# EAGLE design openmv3 (EAGLE 7.2.0)
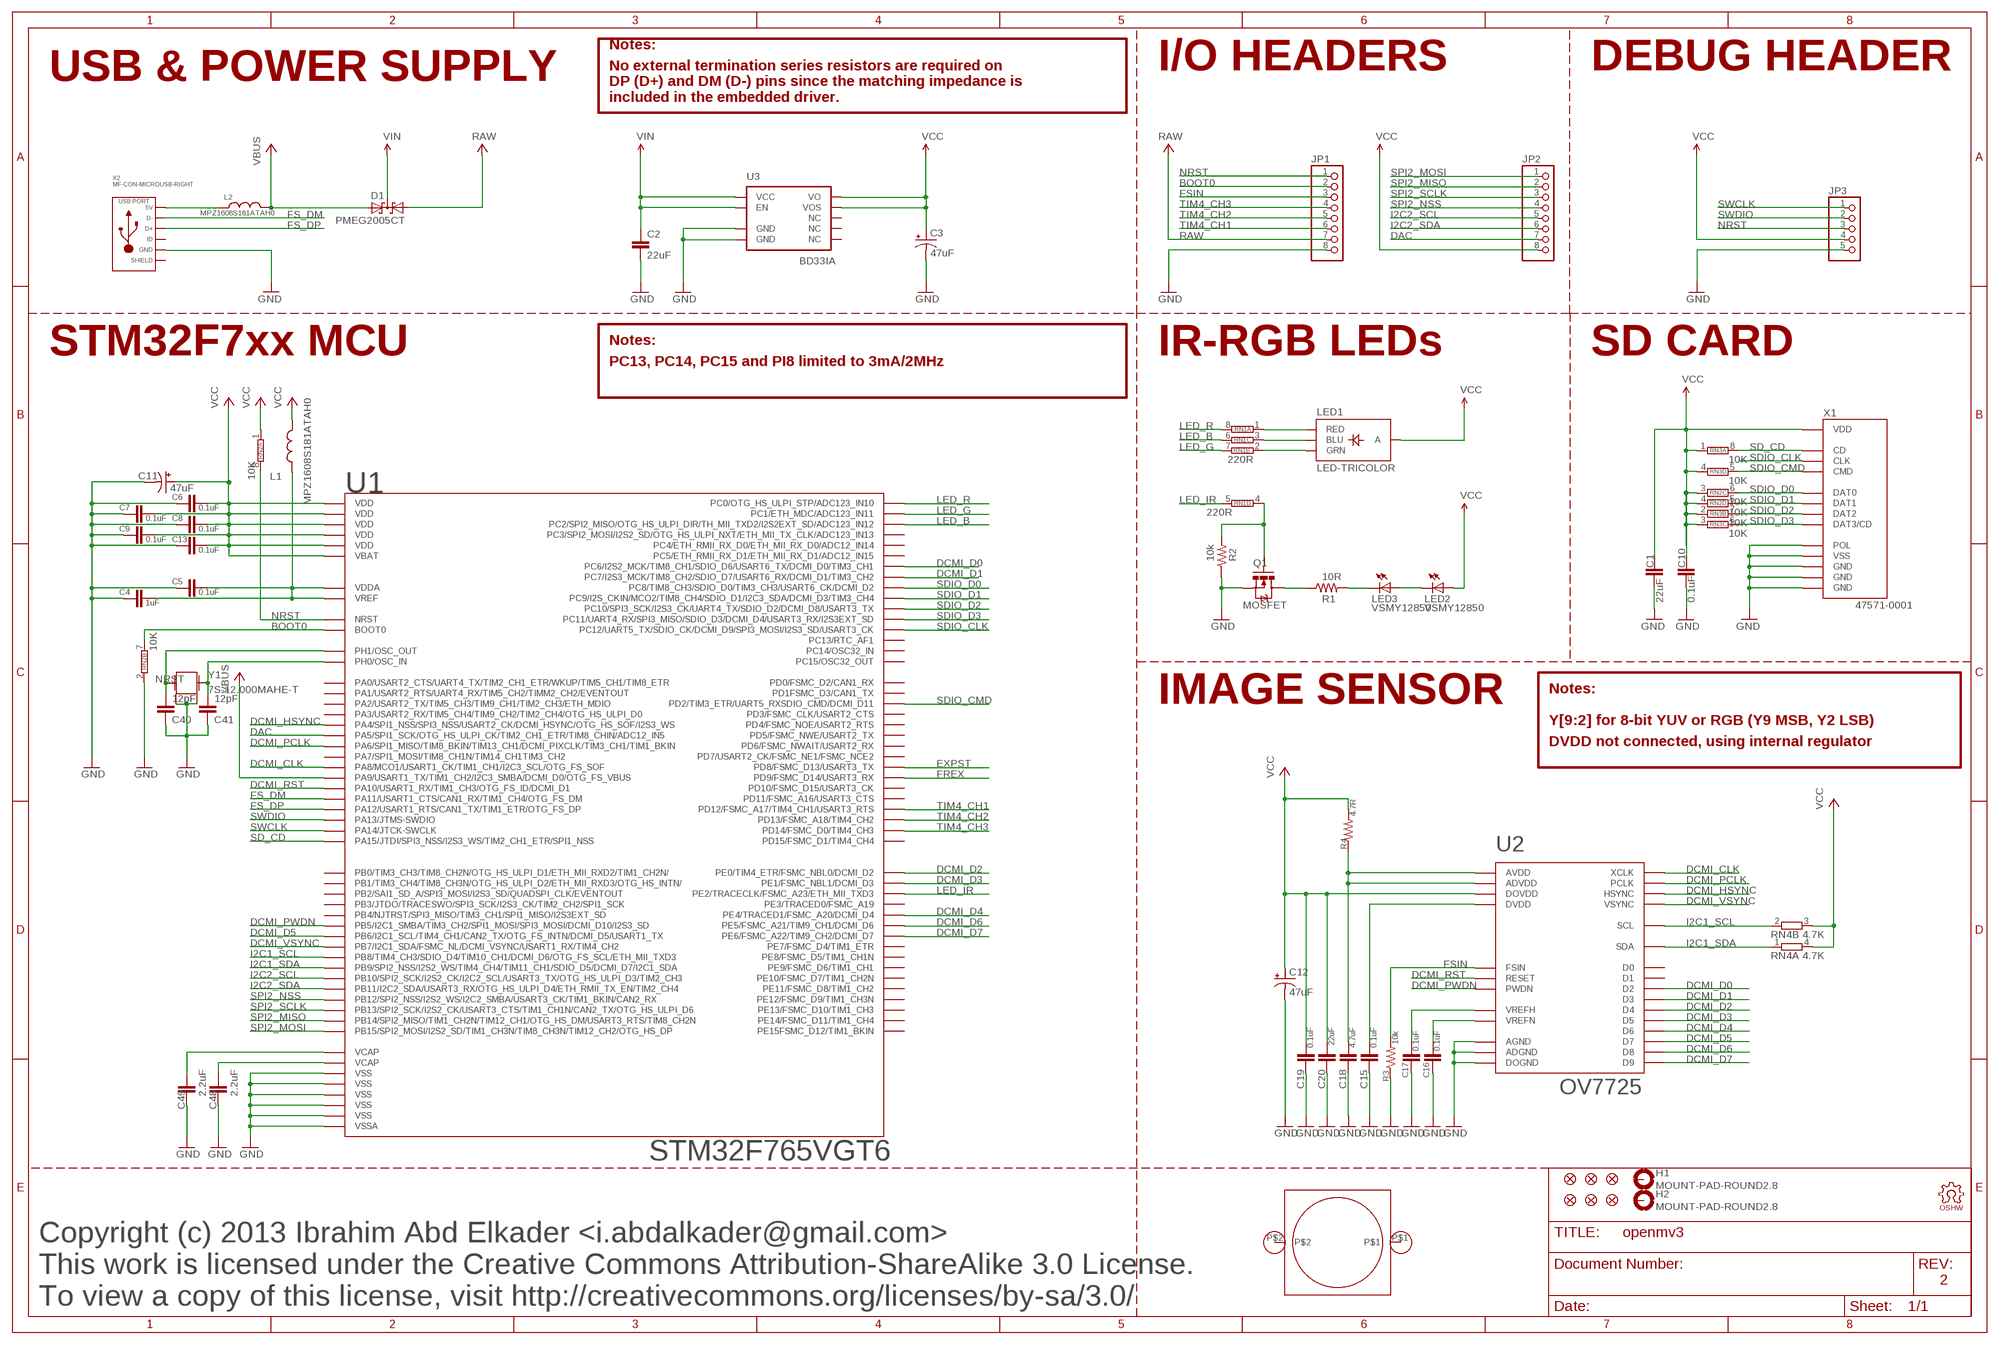
[diagram p0: schematic, sheet 1]

## Parts
C1  22uF  CAP0805  [0805]
C2  22uF  CAP0805  [0805]
C3  47uF  CAP_POL1206  [EIA3216]
C4  1uF  CAP0603-CAP  [0603-CAP]
C5  0.1uF  CAP0603-CAP  [0603-CAP]
C6  0.1uF  CAP0603-CAP  [0603-CAP]
C7  0.1uF  CAP0603-CAP  [0603-CAP]
C8  0.1uF  CAP0603-CAP  [0603-CAP]
C9  0.1uF  CAP0603-CAP  [0603-CAP]
C10  0.1uF  CAP0603-CAP  [0603-CAP]
C11  47uF  CAP_POL1206  [EIA3216]
C12  47uF  CAP_POL1206  [EIA3216]
C13  0.1uF  CAP0603-CAP  [0603-CAP]
C15  0.1uF  CAP0603-CAP  [0603-CAP]
C16  0.1uF  CAP0603-CAP  [0603-CAP]
C17  0.1uF  CAP0603-CAP  [0603-CAP]
C18  4.7uF  CAP0603-CAP  [0603-CAP]
C19  0.1uF  CAP0603-CAP  [0603-CAP]
C20  22uF  CAP0805  [0805]
C40  12pF  CAP0603-CAP  [0603-CAP]
C41  12pF  CAP0603-CAP  [0603-CAP]
C48  2.2uF  CAP0603-CAP  [0603-CAP]
C49  2.2uF  CAP0603-CAP  [0603-CAP]
D1  PMEG2005CT  BAT54C  [SOT23]
F1  FIDUCIAL1X2  [FIDUCIAL-1X2]
F2  FIDUCIAL1X2  [FIDUCIAL-1X2]
F3  FIDUCIAL1X2  [FIDUCIAL-1X2]
F4  FIDUCIAL1X2  [FIDUCIAL-1X2]
F5  FIDUCIAL1X2  [FIDUCIAL-1X2]
F6  FIDUCIAL1X2  [FIDUCIAL-1X2]
H1  MOUNT-PAD-ROUND2.8  [2,8-PAD]
H2  MOUNT-PAD-ROUND2.8  [2,8-PAD]
JP1  PINHD-1X8  [1X08]
JP2  PINHD-1X8  [1X08]
JP3  PINHD-1X5  [1X05]
L1  MPZ1608S181ATAH0  INDUCTOR0603  [0603]
L2  MPZ1608S181ATAH0  INDUCTOR0603  [0603]
LED1  LED-TRICOLOR  [LED-TRICOLOR-SMD-MF]
LED2  VSMY12850  LED1206  [LED-1206]
LED3  VSMY12850  LED1206  [LED-1206]
LM1  LENSMOUNT20MM  [LENSMOUNT-20MM]
LOGO1  OSHW_LOGO_FILLX0100-NT  [OSHW_FILLX100_NOTEXT]
Q1  MOSFET  MOSFET-NCHANNELSMD  [SOT23-3]
R1  10R  RESISTOR0603-RES  [0603-RES]
R2  10k  RESISTOR0603-RES  [0603-RES]
R3  10k  RESISTOR0603-RES  [0603-RES]
R4  4.7R  RESISTOR0603-RES  [0603-RES]
RN1  220R  4R-NEXBV8V  [EXBV8V]
RN2  10K  4R-NEXBV8V  [EXBV8V]
RN3  10K  4R-NEXBV8V  [EXBV8V]
RN4  4.7K  2R-NEXBV4V  [EXBV4V]
U1  STM32F765VGT6  STM32F746LQFP100  [LQFP100]
U2  OV7725  [CSP2-28]
U3  BD33IA  [HTSOP-J8]
X1  47571-0001  USD-47571  [USD-47571]
X2  MF-CON-MICROUSB-RIGHT  USB_MICRO_RIGHT  [MICROUSB-RIGHT]
Y1  7S-12.000MAHE-T  CRYSTAL2.5X2.0  [CRYSTAL-2.5X2.0]

## Nets
BOOT0: JP1.2 RN2.7 U1.94(BOOT0)
DAC: JP2.7 U1.29(PA5/SPI1_SCK/OTG_HS_ULPI_CK/TIM2_CH1_ETR/TIM8_CHIN/ADC12_IN5)
DCMI_CLK: U1.67(PA8/MCO1/USART1_CK/TIM1_CH1/I2C3_SCL/OTG_FS_SOF) U2.F3(XCLK)
DCMI_D0: U1.63(PC6/I2S2_MCK/TIM8_CH1/SDIO_D6/USART6_TX/DCMI_D0/TIM3_CH1) U2.F5(D2)
DCMI_D1: U1.64(PC7/I2S3_MCK/TIM8_CH2/SDIO_D7/USART6_RX/DCMI_D1/TIM3_CH2) U2.F2(D3)
DCMI_D2: U1.97(PE0/TIM4_ETR/FSMC_NBL0/DCMI_D2) U2.D6(D4)
DCMI_D3: U1.98(PE1/FSMC_NBL1/DCMI_D3) U2.D1(D5)
DCMI_D4: U1.3(PE4/TRACED1/FSMC_A20/DCMI_D4) U2.E6(D6)
DCMI_D5: U1.92(PB6/I2C1_SCL/TIM4_CH1/CAN2_TX/OTG_FS_INTN/DCMI_D5/USART1_TX) U2.E1(D7)
DCMI_D6: U1.4(PE5/FSMC_A21/TIM9_CH1/DCMI_D6) U2.F6(D8)
DCMI_D7: U1.5(PE6/FSMC_A22/TIM9_CH2/DCMI_D7) U2.F1(D9)
DCMI_HSYNC: U1.28(PA4/SPI1_NSS/SPI3_NSS/USART2_CK/DCMI_HSYNC/OTG_HS_SOF/I2S3_WS) U2.B6(HSYNC)
DCMI_PCLK: U1.30(PA6/SPI1_MISO/TIM8_BKIN/TIM13_CH1/DCMI_PIXCLK/TIM3_CH1/TIM1_BKIN) U2.E4(PCLK)
DCMI_PWDN: U1.91(PB5/I2C1_SMBA/TIM3_CH2/SPI1_MOSI/SPI3_MOSI/DCMI_D10/I2S3_SD) U2.C1(PWDN)
DCMI_RST: U1.69(PA10/USART1_RX/TIM1_CH3/OTG_FS_ID/DCMI_D1) U2.A2(RESET)
DCMI_VSYNC: U1.93(PB7/I2C1_SDA/FSMC_NL/DCMI_VSYNC/USART1_RX/TIM4_CH2) U2.C6(VSYNC)
EXPST: U1.55(PD8/FSMC_D13/USART3_TX)
FREX: U1.56(PD9/FSMC_D14/USART3_RX)
FS_DM: U1.70(PA11/USART1_CTS/CAN1_RX/TIM1_CH4/OTG_FS_DM) X2.2(D-)
FS_DP: U1.71(PA12/USART1_RTS/CAN1_TX/TIM1_ETR/OTG_FS_DP) X2.3(D+)
FSIN: JP1.3 R3.2 U2.A4(FSIN)
GND: C1.2 C2.2 C3.C(-) C4.2 C5.2 C6.2 C7.2 C8.2 C9.2 C10.2 C11.C(-) C12.C(-) C13.2 C15.2 C16.2 C17.2 C18.2 C19.2 C20.2 C40.1 C41.1 C48.2 C49.2 JP1.8 JP3.5 Q1.2(S) R2.1 R3.1 RN2.2 U1.10(VSS) U1.19(VSSA) U1.26(VSS) U1.49(VSS) U1.74(VSS) U1.99(VSS) U2.B1(ADGND) U2.B4(AGND) U2.F4(DOGND) U3.3(GND) U3.P$1(GND) X1.G$1(GND) X1.G$2(GND) X1.G$3(GND) X1.G$4(POL) X1.P$6(VSS) X2.5(GND) Y1.2 Y1.4
I2C1_SCL: RN4.2 U1.95(PB8/TIM4_CH3/SDIO_D4/TIM10_CH1/DCMI_D6/OTG_FS_SCL/ETH_MII_TXD3) U2.A5(SCL)
I2C1_SDA: RN4.1 U1.96(PB9/SPI2_NSS/I2S2_WS/TIM4_CH4/TIM11_CH1/SDIO_D5/DCMI_D7/I2C1_SDA) U2.B5(SDA)
I2C2_SCL: JP2.5 U1.46(PB10/SPI2_SCK/I2S2_CK/I2C2_SCL/USART3_TX/OTG_HS_ULPI_D3/TIM2_CH3)
I2C2_SDA: JP2.6 U1.47(PB11/I2C2_SDA/USART3_RX/OTG_HS_ULPI_D4/ETH_RMII_TX_EN/TIM2_CH4)
LED_B: RN1.6 U1.17(PC2/SPI2_MISO/OTG_HS_ULPI_DIR/TH_MII_TXD2/I2S2EXT_SD/ADC123_IN12)
LED_G: RN1.7 U1.16(PC1/ETH_MDC/ADC123_IN11)
LED_IR: RN1.5 U1.1(PE2/TRACECLK/FSMC_A23/ETH_MII_TXD3)
LED_R: RN1.8 U1.15(PC0/OTG_HS_ULPI_STP/ADC123_IN10)
N$1: C17.1 U2.A3(VREFH)
N$2: C40.2 U1.13(PH1/OSC_OUT) Y1.3
N$3: C16.1 U2.B2(VREFN)
N$4: C41.2 U1.12(PH0/OSC_IN) Y1.1
N$5: Q1.1(G) R2.2 RN1.4
N$6: LED1.B(BLU) RN1.3
N$7: L2.1 X2.1(5V)
N$8: LED1.R(RED) RN1.1
N$9: LED1.G(GRN) RN1.2
N$10: LED3.C R1.2
N$12: C4.1 C5.1 L1.1 U1.20(VREF) U1.21(VDDA)
N$13: C18.1 R4.1 U2.A1(ADVDD) U2.B3(AVDD)
N$14: Q1.3(D) R1.1
N$15: C15.1 U2.E3(DVDD)
N$17: LED2.C LED3.A
NRST: JP1.1 JP3.3 RN2.8 U1.14(NRST)
RAW: D1.1(A1) JP1.7
SD_CD: RN3.8 U1.77(PA15/JTDI/SPI3_NSS/I2S3_WS/TIM2_CH1_ETR/SPI1_NSS) X1.G$5(CD)
SDIO_CLK: U1.80(PC12/UART5_TX/SDIO_CK/DCMI_D9/SPI3_MOSI/I2S3_SD/USART3_CK) X1.P$5(CLK)
SDIO_CMD: RN3.5 U1.83(PD2/TIM3_ETR/UART5_RXSDIO_CMD/DCMI_D11) X1.P$3(CMD)
SDIO_D0: RN2.6 U1.65(PC8/TIM8_CH3/SDIO_D0/TIM3_CH3/USART6_CK/DCMI_D2) X1.P$7(DAT0)
SDIO_D1: RN2.5 U1.66(PC9/I2S_CKIN/MCO2/TIM8_CH4/SDIO_D1/I2C3_SDA/DCMI_D3/TIM3_CH4) X1.P$8(DAT1)
SDIO_D2: RN3.7 U1.78(PC10/SPI3_SCK/I2S3_CK/UART4_TX/SDIO_D2/DCMI_D8/USART3_TX) X1.P$1(DAT2)
SDIO_D3: RN3.6 U1.79(PC11/UART4_RX/SPI3_MISO/SDIO_D3/DCMI_D4/USART3_RX/I2S3EXT_SD) X1.P$2(DAT3/CD)
SPI2_MISO: JP2.2 U1.53(PB14/SPI2_MISO/TIM1_CH2N/TIM12_CH1/OTG_HS_DM/USART3_RTS/TIM8_CH2N)
SPI2_MOSI: JP2.1 U1.54(PB15/SPI2_MOSI/I2S2_SD/TIM1_CH3N/TIM8_CH3N/TIM12_CH2/OTG_HS_DP)
SPI2_NSS: JP2.4 U1.51(PB12/SPI2_NSS/I2S2_WS/I2C2_SMBA/USART3_CK/TIM1_BKIN/CAN2_RX)
SPI2_SCLK: JP2.3 U1.52(PB13/SPI2_SCK/I2S2_CK/USART3_CTS/TIM1_CH1N/CAN2_TX/OTG_HS_ULPI_D6)
SWCLK: JP3.1 U1.76(PA14/JTCK-SWCLK)
SWDIO: JP3.2 U1.72(PA13/JTMS-SWDIO)
TIM4_CH1: JP1.6 U1.59(PD12/FSMC_A17/TIM4_CH1/USART3_RTS)
TIM4_CH2: JP1.5 U1.60(PD13/FSMC_A18/TIM4_CH2)
TIM4_CH3: JP1.4 U1.61(PD14/FSMC_D0/TIM4_CH3)
VBUS: D1.2(A2) L2.2 U1.68(PA9/USART1_TX/TIM1_CH2/I2C3_SMBA/DCMI_D0/OTG_FS_VBUS)
VCAP1: C49.1 U1.48(VCAP)
VCAP2: C48.1 U1.73(VCAP)
VCC: C1.1 C3.A(+) C6.1 C7.1 C8.1 C9.1 C10.1 C11.A(+) C12.A(+) C13.1 C19.1 C20.1 JP2.8 JP3.4 L1.2 LED1.A LED2.A R4.2 RN2.1 RN2.3 RN2.4 RN3.1 RN3.2 RN3.3 RN3.4 RN4.3 RN4.4 U1.6(VBAT) U1.11(VDD) U1.27(VDD) U1.50(VDD) U1.75(VDD) U1.100(VDD) U2.E5(DOVDD) U3.1(VO) U3.2(VOS) X1.P$4(VDD)
VIN: C2.1 D1.3(CC) U3.5(EN) U3.8(VCC)
Unconnected: H1.B2,8(MOUNT) H2.B2,8(MOUNT) LM1.P$1 LM1.P$2 U1.2(PE3/TRACED0/FSMC_A19) U1.7(PC13/RTC_AF1) U1.8(PC14/OSC32_IN) U1.9(PC15/OSC32_OUT) U1.18(PC3/SPI2_MOSI/I2S2_SD/OTG_HS_ULPI_NXT/ETH_MII_TX_CLK/ADC123_IN13) U1.22(PA0/USART2_CTS/UART4_TX/TIM2_CH1_ETR/WKUP/TIM5_CH1/TIM8_ETR) U1.23(PA1/USART2_RTS/UART4_RX/TIM5_CH2/TIMM2_CH2/EVENTOUT) U1.24(PA2/USART2_TX/TIM5_CH3/TIM9_CH1/TIM2_CH3/ETH_MDIO) U1.25(PA3/USART2_RX/TIM5_CH4/TIM9_CH2/TIM2_CH4/OTG_HS_ULPI_D0) U1.31(PA7/SPI1_MOSI/TIM8_CH1N/TIM14_CH1TIM3_CH2) U1.32(PC4/ETH_RMII_RX_D0/ETH_MII_RX_D0/ADC12_IN14) U1.33(PC5/ETH_RMII_RX_D1/ETH_MII_RX_D1/ADC12_IN15) U1.34(PB0/TIM3_CH3/TIM8_CH2N/OTG_HS_ULPI_D1/ETH_MII_RXD2/TIM1_CH2N/) U1.35(PB1/TIM3_CH4/TIM8_CH3N/OTG_HS_ULPI_D2/ETH_MII_RXD3/OTG_HS_INTN/) U1.36(PB2/SAI1_SD_A/SPI3_MOSI/I2S3_SD/QUADSPI_CLK/EVENTOUT) U1.37(PE7/FSMC_D4/TIM1_ETR) U1.38(PE8/FSMC_D5/TIM1_CH1N) U1.39(PE9/FSMC_D6/TIM1_CH1) U1.40(PE10/FSMC_D7/TIM1_CH2N) U1.41(PE11/FSMC_D8/TIM1_CH2) U1.42(PE12/FSMC_D9/TIM1_CH3N) U1.43(PE13/FSMC_D10/TIM1_CH3) U1.44(PE14/FSMC_D11/TIM1_CH4) U1.45(PE15FSMC_D12/TIM1_BKIN) U1.57(PD10/FSMC_D15/USART3_CK) U1.58(PD11/FSMC_A16/USART3_CTS) U1.62(PD15/FSMC_D1/TIM4_CH4) U1.81(PD0/FSMC_D2/CAN1_RX) U1.82(PD1FSMC_D3/CAN1_TX) U1.84(PD3/FSMC_CLK/USART2_CTS) U1.85(PD4/FSMC_NOE/USART2_RTS) U1.86(PD5/FSMC_NWE/USART2_TX) U1.87(PD6/FSMC_NWAIT/USART2_RX) U1.88(PD7/USART2_CK/FSMC_NE1/FSMC_NCE2) U1.89(PB3/JTDO/TRACESWO/SPI3_SCK/I2S3_CK/TIM2_CH2/SPI1_SCK) U1.90(PB4/NJTRST/SPI3_MISO/TIM3_CH1/SPI1_MISO/I2S3EXT_SD) U2.A6(D0) U2.E2(D1) U3.4(NC) U3.6(NC) U3.7(NC) X2.4(ID) X2.S1(SLD) X2.S2(SLD) X2.S3(SLD) X2.S4(SLD) X2.S5(SLD) X2.S6(SLD)

## Notes on the sheet
- Notes:
- USB & POWER SUPPLY | I/O HEADERS | DEBUG HEADER
- No external termination series resistors are required on
  DP (D+) and DM (D-) pins since the matching impedance is
  included in the embedded driver.
- Notes:
- STM32F7xx MCU | IR-RGB LEDs | SD CARD
- PC13, PC14, PC15 and PI8 limited to 3mA/2MHz
- Notes:
- IMAGE SENSOR
- Y[9:2] for 8-bit YUV or RGB (Y9 MSB, Y2 LSB)
- DVDD not connected, using internal regulator
- Copyright (c) 2013 Ibrahim Abd Elkader <i.abdalkader@gmail.com>
- This work is licensed under the Creative Commons Attribution-ShareAlike 3.0 License.
- 2
- To view a copy of this license, visit http://creativecommons.org/licenses/by-sa/3.0/

## Library data of the parts
C1 C2 C4-C10 C13 C15-C20 C40 C41 C48 C49 = sfe:CAP: Capacitor Standard 0603 ceramic capacitor, and 0.1" leaded capacitor.
C3 C11 C12 = sfe:CAP_POL: Capacitor Polarized These are standard SMD and PTH capacitors. Normally 10uF, 47uF, and 100uF in electrolytic and tantalum varieties. Always verify the external diameter of the through hole cap, it varies with capacity, voltage, and manufacturer. The EIA devices should be standard.
D1 = diode:BAT54C: Schottky Diodes Source: Fairchild .. BAT54.pdf
F1-F6 = sfe:FIDUCIAL: Fiducial Alignment Points Various fiducial points for machine vision alignment.
H1 H2 = holes:MOUNT-PAD-ROUND: MOUNTING PAD, round
JP1 JP2 = pinhead:PINHD-1X8: PIN HEADER
JP3 = pinhead:PINHD-1X5: PIN HEADER
L1 L2 = sfe:INDUCTOR: Inductors Basic Inductor/Choke - 0603 and 1206. Footprints are not proven and vary greatly between part numbers.
LED1 = sfe:LED-TRICOLOR: Tri-Color LED SMD Proven layout and schematic for triple color LED in SMD package - common anode. Spark Fun Electronics SKU : COM-07844
LED2 LED3 = sfe:LED: LEDs Standard schematic elements and footprints for 5mm, 3mm, 1206, and 0603 sized LEDs. 5mm - Spark Fun Electronics SKU : COM-00529 (and others)
LM1 = omnivision:LENSMOUNT
LOGO1 = iofault:OSHW_LOGO_FILL
Q1 = sfe:MOSFET-NCHANNEL
R1-R4 = sfe:RESISTOR: Resistor Basic schematic elements and footprints for 0603, 1206, and PTH resistors.
RN1-RN3 = resistor-dil:4R-N: Array Chip Resistor Source: RS Component / Phycomp; OC_FARNELL: unknown; OC_NEWARK: unknown
RN4 = resistor-dil:2R-N: Array Chip Resistor Source: Panasonic; OC_FARNELL: unknown; OC_NEWARK: unknown
U1 = stm32:STM32F746
U2 = omnivision:OV7725
U3 = mux:BD33IA
X1 = mux:USD-47571
X2 = MF_Connectors:USB: Library: MF_Connectors Description: 5 Pin USB Connectors. SLD is the shield connection. Usually tied to ground through a small ferrite bead.
Y1 = mux:CRYSTAL: Crystals Various standard crystals. Proven footprints. Spark Fun Electronics SKU : COM-00534

## Board
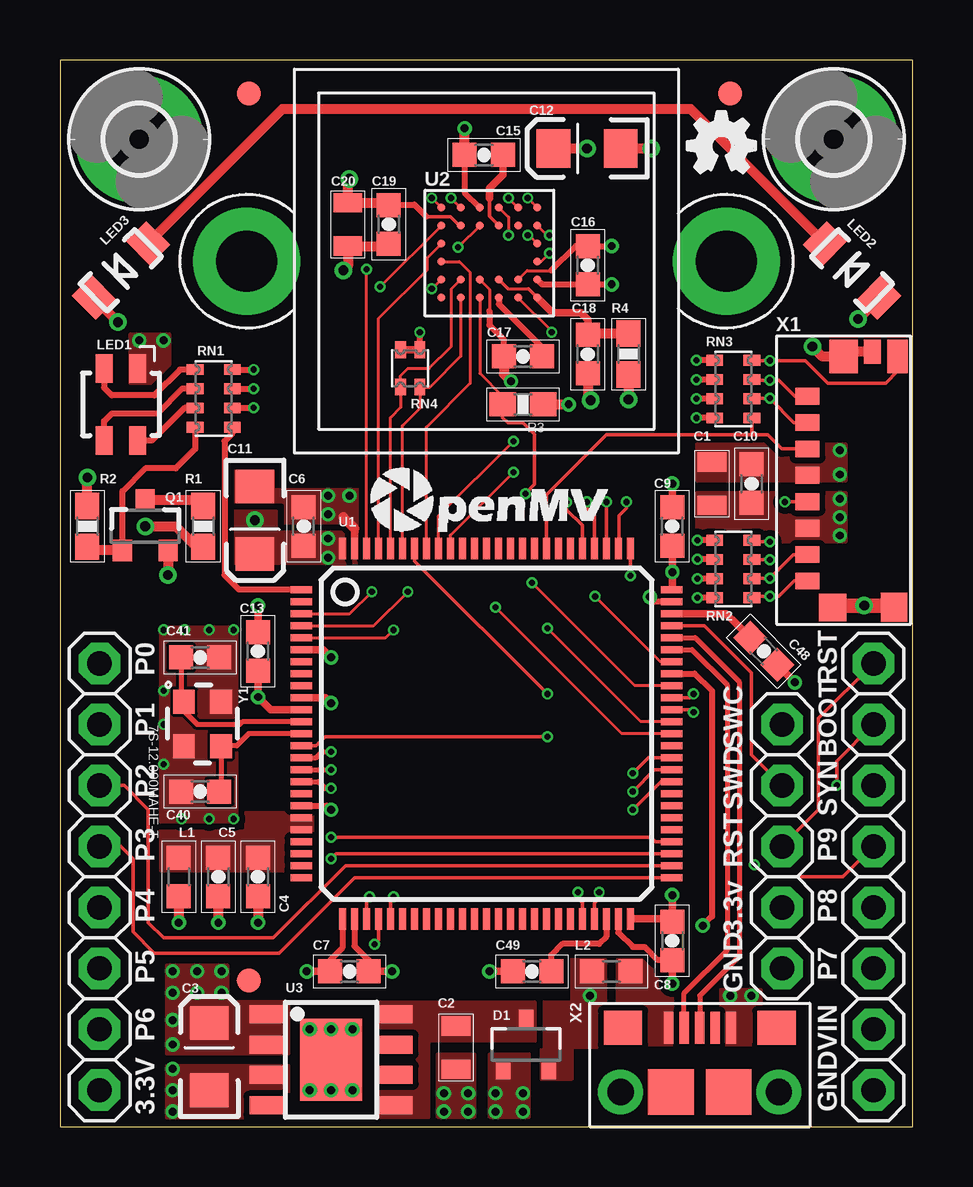
[diagram p1: board, top side]
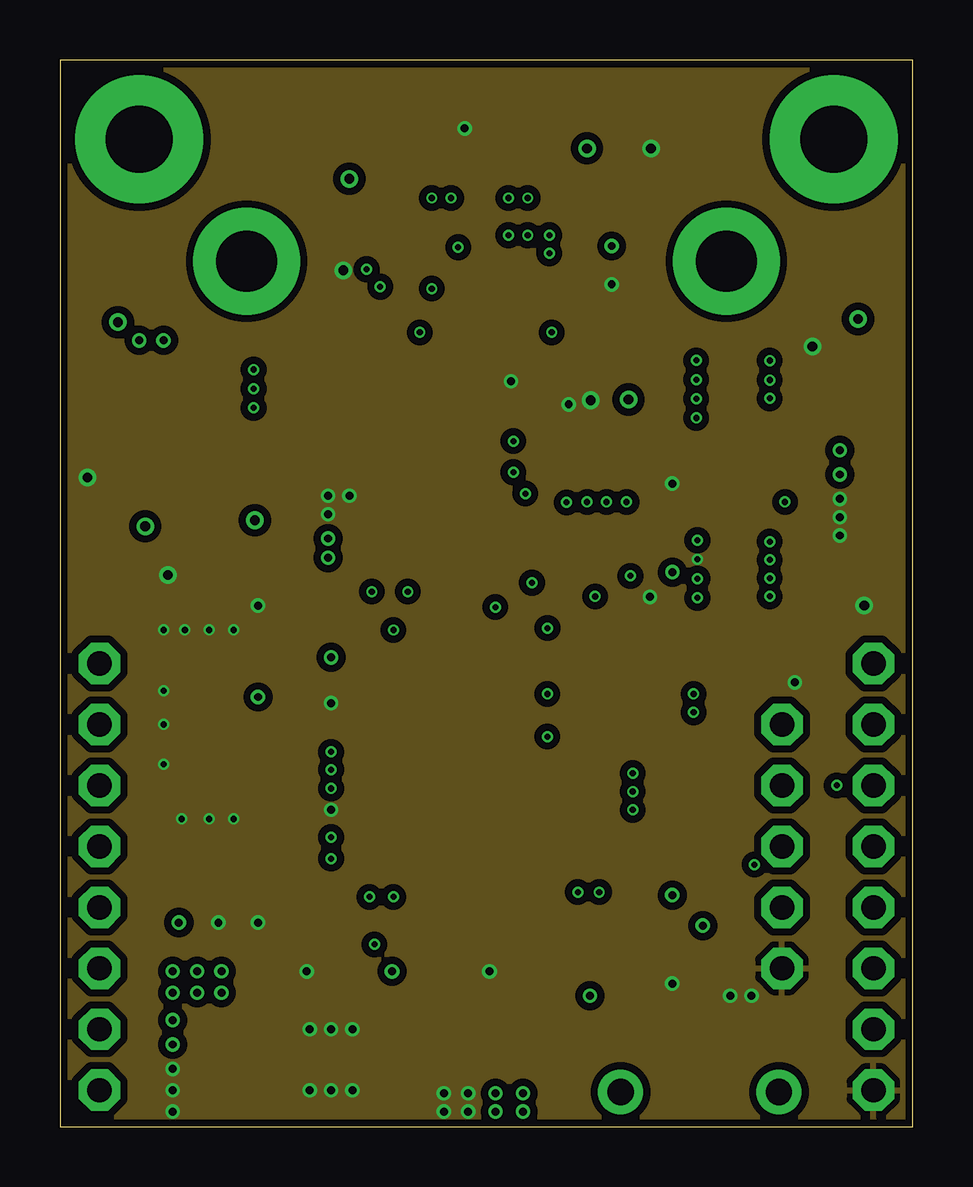
[diagram p2: board, inner layer GND]
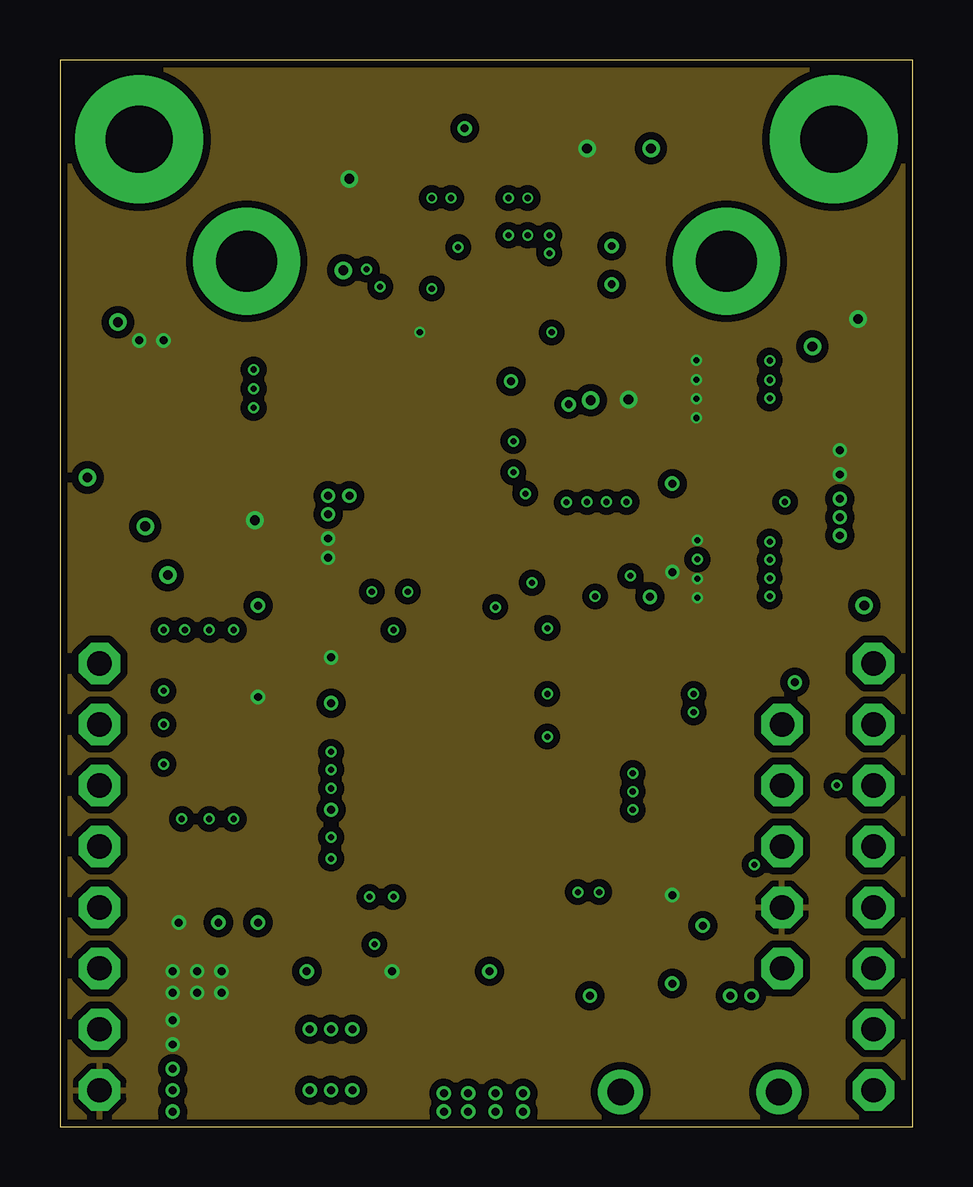
[diagram p3: board, inner layer VCC]
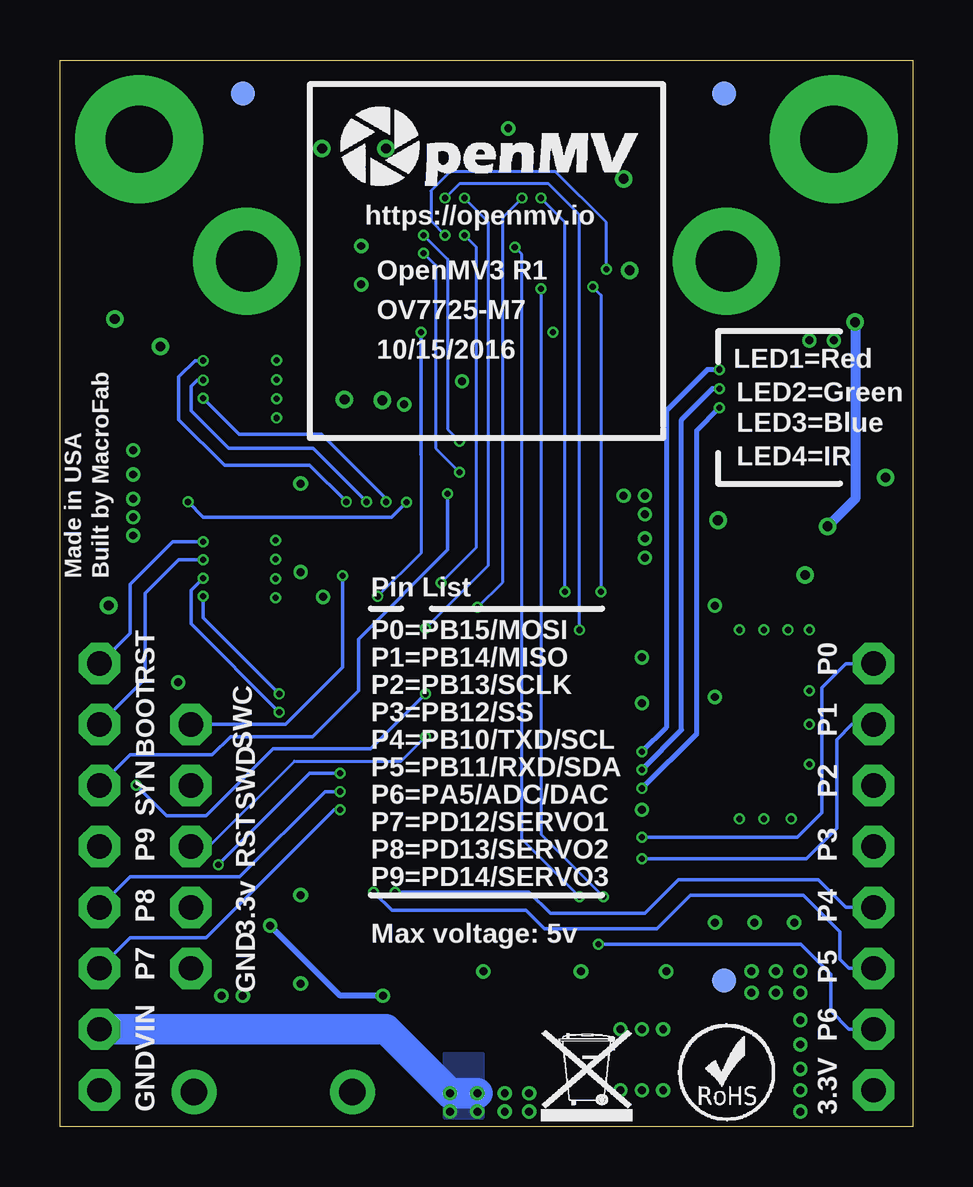
[diagram p4: board, bottom side, seen from below]

Size 35.56 x 44.45 mm. Coordinates in mm from the lower left corner, seen from the top.
Outline: 0,44.45 0,0 35.56,0 35.56,44.45 0,44.45
Copper layers (1*2+15*16): Top 0.035mm / dielectric 1.5mm / GND 0.035mm / dielectric 0.15mm / VCC 0.035mm / dielectric 0.2mm / Bottom 0.035mm
Design rules "default": minimum track width 5mil, minimum drill 10mil, track to track 5mil, track to pad 5mil, pad to pad 5mil, via to via 5mil, smd to smd 5mil, copper to edge 5mil, drill to drill 10mil, minimum pad ring 10mil, minimum via ring 4mil, stop-mask expansion 2mil, vias tented up to drill 30mil, thermal gap 10mil

### Footprints (pad centres in the part's own frame; a part is rotated, then mirrored left to right if it is on the bottom)
0805 = smd 0.8 x 1.2: 1 -0.9,0; 2 0.9,0
EIA3216 = smd 1.4 x 1.6: A 1.4,0; C -1.4,0
0603-CAP = smd 1 x 1: 1 -0.8,0; 2 0.8,0
SOT23 = smd 0.6 x 0.7: 1 -0.95,-1.1; 2 0.95,-1.1; 3 0,1.1
FIDUCIAL-1X2 = smd 1 x 1: 1 0,0
2,8-PAD = drill 2.8 pad 5.334: B2,8 0,0
1X08 = drill 1.016 octagon: 1 -8.89,0; 2 -6.35,0; 3 -3.81,0; 4 -1.27,0; 5 1.27,0; 6 3.81,0; 7 6.35,0; 8 8.89,0
1X05 = drill 1.016 octagon: 1 -5.08,0; 2 -2.54,0; 3 0,0; 4 2.54,0; 5 5.08,0
0603 = smd 1 x 1: 1 -0.8,0; 2 0.8,0
LED-TRICOLOR-SMD-MF = smd 0.7 x 1.2: A 0.7,1.5; B 0.7,-1.5; G -0.7,-1.5; R -0.7,1.5
LED-1206 = smd 1.2 x 1.4: A -1.6,0; C 1.6,0
LENSMOUNT-20MM = drill 2.54 pad 4.445: P$1 -10,0; P$2 10,0
SOT23-3 = smd 0.8 x 0.9: 1 -0.95,-1; 2 0.95,-1; 3 0,1.1
0603-RES = smd 1.1 x 1: 1 -0.85,0; 2 0.85,0
EXBV8V = smd 0.45 x 0.7: 1 -1.2,-0.775; 2 -0.4,-0.775; 3 0.4,-0.775; 4 1.2,-0.775; 5 1.2,0.775; 6 0.4,0.775; 7 -0.4,0.775; 8 -1.2,0.775
EXBV4V = smd 0.45 x 0.7: 1 -0.4,-0.775; 2 0.4,-0.775; 3 0.4,0.775; 4 -0.4,0.775
LQFP100 = smd 0.9 x 0.3: 1 -7.72,6; 2 -7.72,5.5; 3 -7.72,5; 4 -7.72,4.5; 5 -7.72,4; 6 -7.72,3.5; 7 -7.72,3; 8 -7.72,2.5; 9 -7.72,2; 10 -7.72,1.5; 11 -7.72,1; 12 -7.72,0.5; 13 -7.72,0; 14 -7.72,-0.5; 15 -7.72,-1; 16 -7.72,-1.5; 17 -7.72,-2; 18 -7.72,-2.5; 19 -7.72,-3; 20 -7.72,-3.5; 21 -7.72,-4; 22 -7.72,-4.5; 23 -7.72,-5; 24 -7.72,-5.5; 25 -7.72,-6; 51 7.72,-6; 52 7.72,-5.5; 53 7.72,-5; 54 7.72,-4.5; 55 7.72,-4; 56 7.72,-3.5; 57 7.72,-3; 58 7.72,-2.5; 59 7.72,-2; 60 7.72,-1.5; 61 7.72,-1; 62 7.72,-0.5; 63 7.72,0; 64 7.72,0.5; 65 7.72,1; 66 7.72,1.5; 67 7.72,2; 68 7.72,2.5; 69 7.72,3; 70 7.72,3.5; 71 7.72,4; 72 7.72,4.5; 73 7.72,5; 74 7.72,5.5; 75 7.72,6 | smd 0.3 x 0.9: 26 -6,-7.72; 27 -5.5,-7.72; 28 -5,-7.72; 29 -4.5,-7.72; 30 -4,-7.72; 31 -3.5,-7.72; 32 -3,-7.72; 33 -2.5,-7.72; 34 -2,-7.72; 35 -1.5,-7.72; 36 -1,-7.72; 37 -0.5,-7.72; 38 0,-7.72; 39 0.5,-7.72; 40 1,-7.72; 41 1.5,-7.72; 42 2,-7.72; 43 2.5,-7.72; 44 3,-7.72; 45 3.5,-7.72; 46 4,-7.72; 47 4.5,-7.72; 48 5,-7.72; 49 5.5,-7.72; 50 6,-7.72; 76 6,7.72; 77 5.5,7.72; 78 5,7.72; 79 4.5,7.72; 80 4,7.72; 81 3.5,7.72; 82 3,7.72; 83 2.5,7.72; 84 2,7.72; 85 1.5,7.72; 86 1,7.72; 87 0.5,7.72; 88 0,7.72; 89 -0.5,7.72; 90 -1,7.72; 91 -1.5,7.72; 92 -2,7.72; 93 -2.5,7.72; 94 -3,7.72; 95 -3.5,7.72; 96 -4,7.72; 97 -4.5,7.72; 98 -5,7.72; 99 -5.5,7.72; 100 -6,7.72
CSP2-28 = smd 0.34 x 0.34: A1 -2,1.85; A2 -1.2,1.85; A3 -0.4,1.85; A4 0.4,1.85; A5 1.2,1.85; A6 2,1.85; B1 -2,1.1; B2 -1.2,1.1; B3 -0.4,1.1; B4 0.4,1.1; B5 1.2,1.1; B6 2,1.1; C1 -2,0.35; C6 2,0.35; D1 -2,-0.4; D6 2,-0.4; E1 -2,-1.15; E2 -1.2,-1.15; E3 -0.4,-1.15; E4 0.4,-1.15; E5 1.2,-1.15; E6 2,-1.15; F1 -2,-1.9; F2 -1.2,-1.9; F3 -0.4,-1.9; F4 0.4,-1.9; F5 1.2,-1.9; F6 2,-1.9
HTSOP-J8 = smd 0.75 x 1.4: 1 -1.905,-2.7; 2 -0.635,-2.7; 3 0.635,-2.7; 4 1.905,-2.7; 5 1.905,2.7; 6 0.635,2.7; 7 -0.635,2.7; 8 -1.905,2.7 | smd 3.4 x 2.6: P$1 0,0
USD-47571 = smd 1.15 x 1.15: G$1 -4.9,0.55 | smd 1.2 x 1.1: G$2 -4.9,-2 | smd 1.4 x 1.2: G$3 5.55,0.1 | smd 1 x 0.7: G$4 5.75,-1.1 | smd 1.4 x 0.85: G$5 5.55,-2.15 | smd 0.7 x 1: P$1 3.9,1.6; P$2 2.8,1.6; P$3 1.7,1.6; P$4 0.6,1.6; P$5 -0.5,1.6; P$6 -1.6,1.6; P$7 -2.7,1.6; P$8 -3.8,1.6
MICROUSB-RIGHT = smd 0.4 x 1.35: 1 -1.3,1.27; 2 -0.65,1.27; 3 0,1.27; 4 0.65,1.27; 5 1.3,1.27 | drill 1.1: S1 -3.3,-1.405; S2 3.3,-1.405 | smd 1.6 x 1.4: S3 -3.2,1.27; S4 3.2,1.27 | smd 1.9 x 1.9: S5 -1.2,-1.405; S6 1.2,-1.405
CRYSTAL-2.5X2.0 = smd 1 x 0.9: 1 -0.95,-0.8; 2 0.9,-0.8; 3 0.9,0.75; 4 -0.95,0.75

### Placement (x,y rotation side)
C1  27.18,26.8 270 top
C2  16.51,3.3 270 top
C3  6.22,2.92 90 top
C4  8.26,10.41 270 top
C5  6.6,10.41 270 top
C6  10.16,25.02 90 top
C7  12.06,6.48 180 top
C8  25.53,7.75 270 top
C9  25.53,25.02 90 top
C10  28.83,26.8 270 top
C11  8.13,25.27 270 top
C12  21.97,40.77 180 top
C13  8.26,19.81 90 top
C15  17.67,40.5 180 top
C16  22,35.9 270 top
C17  19.3,32.1 180 top
C18  22,32.2 270 top
C19  13.7,37.6 270 top
C20  12,37.6 270 top
C40  5.84,13.97 0 top
C41  5.84,19.56 180 top
C48  29.34,19.81 315 top
C49  19.68,6.48 180 top
D1  19.43,3.43 0 top
F1  7.87,6.1 0 top
F2  7.87,43.05 0 top
F3  27.94,43.05 0 top
F4  7.87,6.1 0 bottom
F5  7.87,43.05 0 bottom
F6  27.94,43.05 0 bottom
H1  3.3,41.15 90 top
H2  32.26,41.15 270 top
JP1  33.91,10.41 270 top
JP2  1.65,10.41 270 top
JP3  30.1,11.68 270 top
L1  4.95,10.41 270 top
L2  22.99,6.48 180 top
LED1  2.54,30.1 0 top
LED2  33.02,35.69 135 top
LED3  2.54,35.69 225 top
LM1  17.78,36.07 0 top
LOGO1  26.16,39.75 0 top
Q1  3.56,25.02 0 top
R1  5.97,25.02 270 top
R2  1.14,25.02 270 top
R3  19.3,30.1 180 top
R4  23.7,32.2 270 top
RN1  6.41,30.35 270 top
RN2  28.07,23.24 270 top
RN3  28.07,30.73 270 top
RN4  14.6,31.6 0 top
U1  17.78,16.38 0 top
U2  17.9,36.4 180 top
U3  11.3,2.79 270 top
U$1  [WEEE]  15.49,0.25 0 bottom
U$2  [ROHS]  9.78,0.25 0 bottom
U$3  [OMV-LOGO]  24,38.99 0 bottom
U$4  [OMV-LOGO-SMALL]  12.83,24.64 0 top
X1  32.77,26.54 90 top
X2  26.67,2.86 0 top
Y1  5.97,16.76 270 top

### Tracks (layer width: path | path; a pad name or v marks a point on that pad's centre or on a via)
BOOT0  (via drill 0.25)
  Top 0.152: RN2.7 28.86,23.62 v29.59,23.62 | v32.38,14.22 32.38,15.24 JP1.2 | U1.94 14.78,23.57 v20.32,18.03
  Bottom 0.152: v29.59,23.62 30.61,23.62 32,22.23 32,18.67 JP1.2 | v32.38,14.22 31.11,12.95 29.46,12.95 26.67,15.75 22.61,15.75 v20.32,18.03
DAC  (via drill 0.25)
  Top 0.152: U1.29 13.28,7.77 v13.11,7.6
  Bottom 0.152: v13.11,7.6 4.68,7.6 3.43,6.35 3.43,4.83 2.67,4.06 JP2.7
DCMI_CLK  (via drill 0.25)
  Top 0.127: U2.F3 18.35,38.3 18.35,38.25 18.7,37.9 v18.7,37.15 | U1.67 23.96,18.38 v19.68,22.67
  Bottom 0.127: v19.68,22.67 18.2,24.15 18.2,36.65 v18.7,37.15
DCMI_D0  (via drill 0.25)
  Top 0.127: v18.15,21.65 23.42,16.38 U1.63 | U2.F5 v16.3,38.7
  Bottom 0.127: v18.15,21.65 17.1,22.7 17.1,37.9 v16.3,38.7
DCMI_D1  (via drill 0.25)
  Top 0.127: U1.64 24.22,16.88 v20.32,20.78 | U2.F2 v18.7,38.7
  Top 0.152: U1.64 arc-90 U1.64
  Bottom 0.127: v20.32,20.78 17.7,23.4 17.7,37.7 v18.7,38.7
DCMI_D2
  Top 0.127: U1.97 13.28,33.68 15.3,35.7 15.3,36.2 U2.D6
DCMI_D3  (via drill 0.25)
  Top 0.127: U1.98 v12.78,35.73 | v19.5,37.15 19.55,37.15 U2.D1
  Bottom 0.127: v12.78,35.73 12.78,37.68 14.9,39.8 19.3,39.8 20.1,39 20.1,37.75 v19.5,37.15
DCMI_D4  (via drill 0.25)
  Top 0.127: U1.3 12.08,21.38 v13,22.3 | U2.E6 v13.35,35
  Bottom 0.127: v13,22.3 13,34.65 v13.35,35
DCMI_D5  (via drill 0.25)
  Top 0.127: v20.4,37.15 20.3,37.15 U2.E1 | U1.92 15.78,25.45 v18.9,28.57
  Bottom 0.127: v20.4,37.15 19.4,36.15 19.4,29.07 v18.9,28.57
DCMI_D6  (via drill 0.25)
  Top 0.127: U2.F6 v15.5,38.7 | U1.4 13.08,20.88 v14.5,22.3
  Bottom 0.127: v14.5,22.3 14.5,37.7 v15.5,38.7
DCMI_D7  (via drill 0.25)
  Top 0.127: 19.95,38.3 U2.F1 v19.5,38.7 | U1.5 13.58,20.38 v13.9,20.7
  Bottom 0.127: v19.5,38.7 18.9,39.3 15.2,39.3 13.9,38 v13.9,20.7
DCMI_HSYNC  (via drill 0.25)
  Top 0.127: U2.B6 15.88,35.3 v15.5,34.92
  Top 0.152: U1.28 12.78,9.46 v12.9,9.58
  Bottom 0.127: v15.5,34.92 15.5,12.18 v12.9,9.58
DCMI_PCLK  (via drill 0.25)
  Top 0.127: 17.5,37.56 U2.E4 v16.6,36.65
  Top 0.152: U1.30 13.78,9.46 v13.9,9.58
  Bottom 0.127: v13.9,9.58 16.3,11.98 16.3,36.35 v16.6,36.65
DCMI_PWDN  (via drill 0.25)
  Top 0.127: U2.C1 20.05,36.05 v20.4,36.4 | v18.9,27.27 16.28,24.65 U1.91
  Bottom 0.127: v20.4,36.4 19.9,35.9 19.9,28.27 v18.9,27.27
DCMI_RST  (via drill 0.25)
  Top 0.127: U1.69 25.02,19.38 v22.31,22.1 | v20.5,33.1 20.5,33.15 U2.A2
  Bottom 0.127: v22.31,22.1 20.5,23.91 20.5,27.99
  Bottom 0.152: v20.5,33.1 20.5,27.99
DCMI_VSYNC
  Top 0.127: U2.C6 16.65,36.05 17.1,35.6 17.1,30.97 15.28,29.15 U1.93
FS_DM
  Top 0.203: U1.70 26.34,19.88 27.81,18.41 27.81,7.37 26.02,5.57 X2.2
FS_DP
  Top 0.203: U1.71 26.48,20.38 28.32,18.54 28.32,7.11 26.67,5.46 X2.3
FSIN  (via drill 0.25)
  Top 0.127: U2.A4 17.5,31.39 18.45,30.44 R3.2
  Top 0.152: R3.2 18.45,29.55 18.67,29.34 19.3,29.34 19.78,28.86 19.78,26.77 v19.4,26.38
  Bottom 0.152: v19.4,26.38 19.4,24.04 23.11,20.32 23.11,18.16 25.02,16.26 28.45,16.26 29.21,15.49 32.64,15.49 JP1.3
GND  (via drill 0.25, 0.33, 0.33 pad 0.61, 0.41, 0.41 pad 0.61)
  Top 0.127: U2.B4 17.9,34.9 17.9,34
  Top 0.254: U2.F4 16.87,38.93 C15.2 | v23,35.1 C16.2 20.1,35.1 U2.B1 | 17.9,34 17.9,33.4 18.5,32.8 C17.2 | U1.26 11.78,7.46 11.27,6.95 C7.2 | U1.49 23.28,8.09 23.88,7.49 24.38,7.49 24.93,6.95 C8.2 | U1.19 11.13,13.38 v11.3,13.21 | RN2.2 v26.57,23.64 | U1.74 24.79,21.88 v24.59,22.08
  Top 0.305: C48.2 v30.63,18.52 | U1.99 12.28,24.93 | C7.2 v10.29,6.48 | C49.2 v17.91,6.48 | C9.2 v25.53,26.8 | C8.2 v25.53,5.97 | U1.10 11.07,17.88 v11.3,17.65 | C13.2 v8.26,21.72
  Top 0.406: X1.P$6 31.24,25.02 | X1.G$4 32.87,32.29 X1.G$3 31.79,32.09 v31.37,32.51 | 12.28,24.93 11.81,25.4 | C5.2 v6.6,8.51 | C4.2 v8.26,8.51 | R2.1 v1.14,27.05 | C15.2 v16.87,41.6 | C17.2 18.5,31.36 v18.8,31.06 | R3.1 v21.21,30.1 | C12.C v24.64,40.77 | C19.2 13.6,36.7 C20.2 12,35.88 v11.81,35.69 | Q1.2 v4.51,23 v4.5,22.99 | C18.2 22,30.4 v22.13,30.27
  Top 0.61: X1.G$2 34.69,21.72 v33.53,21.72 32.29,21.72 arc90 X1.G$1 | U3.P$1 v11.3,1.52
  other vias: 4.32,20.7 4.32,16.76 5.08,12.83 5.21,20.7 7.24,12.83 4.32,18.16 4.32,15.11 17.02,0.64 16,0.64 32.51,24.64 32.51,25.4 28.83,5.46 27.94,5.46 16,1.4 17.02,1.4 4.7,0.64 4.7,1.52 4.7,2.41 6.22,12.83 7.24,20.7 6.22,20.7 11.18,26.29 12.06,26.29 32.51,26.16 12.19,4.06 12.19,1.52 10.41,1.52 10.41,4.06 11.3,4.06 11.18,25.53
  pour GND (isolate 0.305): 0,0 0,44.45 35.56,44.45 35.56,0
  pour Top (isolate 0.254, no thermals): 26.54,26.42 32.77,26.42 32.77,24.38 29.34,24.38 29.34,24.89 26.54,24.89
  pour Top (isolate 0.203, no thermals): 27.56,3.43 27.56,5.71 29.21,5.71 29.21,3.43
  pour Top (isolate 0.254, rank 2, no thermals): 4.45,0.38 4.45,2.54 9.53,2.54 9.53,0.38
  pour Top (isolate 0.254, rank 2, no thermals): 7.24,27.3 8.89,27.3 8.89,26.54 12.45,26.54 12.45,23.5 7.24,23.5
  pour Top (no thermals): 4.19,20.83 7.37,20.83 7.37,12.7 4.19,12.7
  pour Top (isolate 0.254, no thermals): 15.75,3.05 17.27,3.05 17.27,0.38 15.75,0.38
I2C1_SCL
  Top 0.127: U1.95 14.28,29.22 15,29.94 RN4.2 15.43,30.82 16.7,32.1 U2.A5
I2C1_SDA
  Top 0.127: U1.96 13.78,29.55 14.2,29.97 RN4.1 14.2,31.3 14.5,31.6 15.39,31.6 16.31,32.51 16.31,34.91 U2.B5
I2C2_SCL  (via drill 0.25)
  Top 0.152: v21.59,9.78 21.59,9.53 21.77,9.34 U1.46
  Bottom 0.152: v21.59,9.78 16,9.78 15.11,8.89 11.18,8.89 9.78,10.29 3.94,10.29 2.79,9.14 JP2.5
I2C2_SDA  (via drill 0.25)
  Top 0.152: v22.48,9.78 22.48,9.53 22.27,9.32 U1.47
  Bottom 0.152: v22.48,9.78 21.72,9.02 16.13,9.02 15.37,8.26 10.67,8.26 9.27,9.65 4.57,9.65 3.05,8.13 3.05,6.99 2.67,6.6 JP2.6
LED_B  (via drill 0.25)
  Top 0.203: v11.3,14.1 11.05,14.1 10.79,14.35 10.76,14.38 U1.17
  Top 0.254: RN1.6 v8.07,29.95
  Bottom 0.203: v11.3,14.1 9.02,16.38 9.02,29.01 v8.07,29.95
LED_G  (via drill 0.25)
  Top 0.203: U1.16 v11.3,14.88
  Top 0.254: RN1.7 v8.07,30.75
  Bottom 0.203: v11.3,14.88 9.65,16.53 9.65,29.46 8.36,30.75 v8.07,30.75
LED_IR
  Top 0.254: RN1.5 7.19,28.91 6.86,28.57 6.86,22.99 7.46,22.38 U1.1
LED_R  (via drill 0.25)
  Top 0.203: U1.15 10.68,15.38 10.92,15.62 v11.3,15.62
  Top 0.254: RN1.8 v8.07,31.55
  Bottom 0.203: v11.3,15.62 10.29,16.64 10.29,29.84 8.58,31.55 v8.07,31.55
N$1
  Top 0.254: U2.A3 18.3,34.27 20.1,32.47 C17.1
N$2
  Top 0.203: C40.2 arc90 6.72,14.05 Y1.3 6.73,15.88 7.37,15.88 7.87,16.38 U1.13
N$3  (via drill 0.33)
  Top 0.127: U2.B2 19.48,35.67 20.48,35.67
  Top 0.254: 20.48,35.67 21.5,36.7 C16.1 v23,36.7
N$4
  Top 0.203: C41.2 5.04,17.71 Y1.1 5.17,17.31 5.71,16.76 7.49,16.76 7.62,16.89 U1.12
N$5
  Top 0.254: Q1.1 2.61,26.48 3.56,27.43 4.83,27.43 5.64,28.24 RN1.4
  Top 0.406: Q1.1 1.29,24.02 R2.2
N$6
  Top 0.254: RN1.3 5.19,29.95 3.83,28.6 LED1.B
N$7
  pour Top (isolate 0.254, no thermals): 25.53,6.96 23.24,6.96 23.24,3.43 25.53,3.43
N$8
  Top 0.254: RN1.1 5.01,31.55 3.94,30.48 2.16,30.48 1.84,30.8 LED1.R
N$9
  Top 0.254: RN1.2 5.1,30.75 4.06,29.72 2.16,29.72 1.84,29.4 LED1.G
N$10  (via drill 0.41, 0.41 pad 0.61)
  Top 0.406: v2.41,33.53 2.41,33.55 LED3.C | v3.56,25.02 4.83,25.02 5.68,24.17 R1.2
  Bottom 0.406: v2.41,33.53 2.41,26.16 v3.56,25.02
N$12
  pour Top (isolate 0.254, rank 2, no thermals): 4.19,12.45 7.75,12.45 7.75,13.08 10.54,13.08 10.54,10.67 4.19,10.67
N$13
  Top 0.127: 18.68,34.92 19.52,34.92
  Top 0.152: U2.B3 18.68,34.92 | 19.52,34.92 U2.A1
  Top 0.305: C18.1 22,33.63 21.72,33.91 20.54,33.91 U2.A1
  Top 0.406: R4.1 22.05,33.05 C18.1
N$14
  Top 0.406: Q1.3 5.72,26.12 R1.1
N$15
  Top 0.152: 17.9,38.7 17.9,37.95 U2.E3
  Top 0.305: 17.9,38.7 17.9,39.1 18.47,39.67 C15.1
N$17
  Top 0.406: LED3.A 9.27,42.42 26.29,42.42 | LED2.C 26.29,42.42 | 26.29,42.42
NRST  (via drill 0.25)
  Top 0.152: U1.14 10.68,15.88 11.05,16.26 v20.32,16.26 | RN2.8 28.9,24.38 v29.59,24.38 | JP1.1 31.62,17.02 31.62,13.21 JP3.3
  Bottom 0.127: JP3.3 29.34,11.68 25.78,15.24 21.34,15.24 v20.32,16.26
  Bottom 0.152: v29.59,24.38 30.86,24.38 32.64,22.61 32.64,20.57 JP1.1
RAW  (via drill 0.33)
  Bottom 1.27: JP1.7 21.97,4.06 v19.3,1.4 v18.16,1.4
  other vias: 19.3,0.64 18.16,0.64
  pour Top (isolate 0.254, rank 2, no thermals): 17.91,3.05 19.56,3.05 19.56,0.38 17.91,0.38
  pour Bottom (isolate 0.254, rank 2, no thermals): 17.91,3.05 19.56,3.05 19.56,0.38 17.91,0.38
SD_CD  (via drill 0.25)
  Top 0.152: U1.77 arc90 23.29,24.11 23.29,25.45 23.62,25.78 v23.62,26.04 | RN3.8 arc-90 RN3.8 arc90 RN3.8 | RN3.8 v29.59,31.93 31.06,31.93 32,30.99 34.42,30.99 34.92,31.49 X1.G$5
  Bottom 0.152: v23.62,26.04 25.15,27.56 28.7,27.56 30.61,29.46 30.61,31.24 29.92,31.93 v29.59,31.93
SDIO_CLK  (via drill 0.25)
  Top 0.152: U1.80 21.78,25.06 21.12,25.72 v21.12,26.02 | v30.23,26.04 31.16,26.04 X1.P$5
  Bottom 0.152: v21.12,26.02 21.74,25.4 29.59,25.4 v30.23,26.04
SDIO_CMD
  Top 0.152: U1.83 20.28,26.33 22.78,28.83 28.8,28.83 | X1.P$3 30.1,28.24 29.52,28.83 28.8,28.83 | RN3.5 28.84,28.87 28.8,28.83
SDIO_D0  (via drill 0.25)
  Top 0.152: RN2.6 arc-90 28.86,22.86 v29.59,22.86 30.57,23.84 X1.P$7 | U1.65 26.3,17.38 v26.42,17.27
  Bottom 0.152: v26.42,17.27 30.1,20.95 30.1,22.35 v29.59,22.86
SDIO_D1  (via drill 0.25)
  Top 0.152: RN2.5 arc-90 28.9,22.1 v29.59,22.1 29.97,22.1 30.62,22.74 X1.P$8 | U1.66 26.27,17.88 v26.42,18.03
  Top 0.203: 28.9,22.1 RN2.5
  Bottom 0.152: v26.42,18.03 29.59,21.21 v29.59,22.1
SDIO_D2  (via drill 0.25)
  Top 0.152: U1.78 arc-90 U1.78 v22.78,26.03 v22.78,26.04 | RN3.7 arc90 RN3.7 28.84,31.11 v29.59,31.11 29.97,31.11 30.64,30.44 X1.P$1
  Bottom 0.152: v22.78,26.04 25.02,28.27 28.52,28.27 30.1,29.84 30.1,30.86 29.84,31.11 v29.59,31.11
SDIO_D3  (via drill 0.25)
  Top 0.152: U1.79 arc-90 U1.79 22.28,25.48 21.97,25.78 v21.97,26.04 | RN3.6 arc-90 RN3.6 28.86,30.35 v29.59,30.35 30.6,29.34 X1.P$2
  Bottom 0.152: v21.97,26.04 21.97,26.16 24.66,28.85 28.09,28.85 v29.59,30.35
SPI2_MISO  (via drill 0.25)
  Top 0.152: U1.53 11.51,11.38 v11.3,11.18
  Bottom 0.152: v11.3,11.18 4.45,11.18 3.17,12.45 3.17,16.13 2.54,16.76 JP2.2
SPI2_MOSI  (via drill 0.25)
  Top 0.152: v11.3,12.06 24.64,12.06 24.82,11.88 U1.54
  Bottom 0.152: v11.3,12.06 4.83,12.06 3.81,13.08 3.81,18.29 2.79,19.3 JP2.1
SPI2_NSS
  Top 0.152: U1.51 12.29,10.38 9.14,7.24 3.94,7.24 3.05,8.13 3.05,11.18 2.54,11.68 JP2.4
SPI2_SCLK
  Top 0.152: U1.52 11.9,10.88 8.89,7.87 4.32,7.87 3.68,8.51 3.68,13.21 2.67,14.22 JP2.3
SWCLK  (via drill 0.25)
  Top 0.152: U1.76 v23.78,22.96
  Bottom 0.152: v23.78,22.96 23.78,19.15 26.16,16.76 JP3.1
SWDIO
  Top 0.152: U1.72 26.87,20.88 28.83,18.92 28.83,15.49 JP3.2
TIM4_CH1  (via drill 0.25)
  Top 0.152: U1.59 25.05,14.38 v23.88,13.21
  Bottom 0.152: JP1.6 32.64,7.87 29.46,7.87 24.13,13.21 v23.88,13.21
TIM4_CH2  (via drill 0.25)
  Top 0.152: U1.60 24.79,14.88 v23.88,13.97
  Bottom 0.152: JP1.5 32.64,10.41 28.07,10.41 24.51,13.97 v23.88,13.97
TIM4_CH3  (via drill 0.25)
  Top 0.152: JP1.4 32.64,10.41 29.46,10.41 v28.96,10.92 | U1.61 24.53,15.38 v23.88,14.73
  Bottom 0.152: v28.96,10.92 25.15,14.73 v23.88,14.73
VBUS  (via drill 0.33)
  Top 0.254: U1.68 26.46,18.88 27.18,18.16 27.18,8.76 v26.8,8.38
  Bottom 0.254: v22.1,5.46 23.88,5.46 v26.8,8.38
  pour Top (isolate 0.254, rank 2, no thermals): 22.73,6.99 22.73,3.3 21.34,3.3 21.34,1.96 20.07,1.96 20.07,5.21 21.34,5.21 21.34,6.99
VCAP1
  Top 0.254: C49.1 20.48,7.15 20.95,7.62 22.48,7.62 22.78,7.92 U1.48
VCAP2
  Top 0.305: U1.73 27.77,21.38 28.19,20.95 | 28.19,20.95 | 28.19,20.95 C48.1
VCC  (via drill 0.25, 0.33, 0.33 pad 0.61, 0.41)
  Top 0.152: U2.E5 16.65,37.55 16.27,37.92 15.28,37.92
  Top 0.254: 15.28,37.92 14.78,38.42 13.72,38.42 | RN4.3 v15,33.1 | U1.27 12.28,7.53 12.87,6.95 C7.1 | RN2.1 v26.57,24.44 | RN2.3 v26.57,22.84 | RN2.4 v26.57,22.04 | RN3.1 v26.52,31.93 | RN3.2 v26.52,31.13 | RN3.3 v26.52,30.33 | RN3.4 v26.52,29.53
  Top 0.305: U1.75 25.53,22.41 v25.53,23.11 C9.1 | C7.1 v13.84,6.48 | U1.11 8.78,17.38 v8.26,17.91 C13.1 | U1.50 25.41,8.66 C8.1 v25.53,9.65 | 13.72,38.42 C19.1 | U1.6 10.98,19.88 v11.3,19.56 | RN4.4 RN4.3
  Top 0.406: L1.2 v4.95,8.51 | v33.27,33.66 34.15,34.53 LED2.A | R4.2 v23.7,30.3 | C12.A v21.97,40.77 | C19.1 13.6,38.5 C20.1 12,39.43 v12.06,39.5
  other vias: 32.51,27.18 32.51,28.19 5.71,6.48 4.7,6.48 6.73,6.48 11.18,24.51 4.32,32.77 11.18,23.71 6.73,5.59 5.71,5.59 4.7,3.43 4.7,4.45 4.7,5.59 3.3,32.77 8.13,25.27
  pour VCC (isolate 0.305): 0.38,0.38 0.38,44.07 35.18,44.07 35.18,0.38
  pour Top (isolate 0.254, no thermals): 26.54,28.45 32.77,28.45 32.77,26.92 26.54,26.92
  pour Top (isolate 0.254, no thermals): 4.45,6.73 6.99,6.73 6.99,5.21 9.53,5.21 9.53,3.05 4.45,3.05
  pour Top (isolate 0.254, no thermals): 7.24,25.65 9.02,25.65 9.02,24.77 11.94,24.77 11.94,23.48 7.24,23.48
  pour Top (isolate 0.254, no thermals): 2.92,33.02 2.92,30.99 4.57,30.99 4.57,33.02
VIN
  pour Top (isolate 0.254, no thermals): 19.81,5.21 19.81,3.56 15.37,3.56 15.37,0.38 13.34,0.38 13.34,5.21

### Text on the board
tPlace: P0 | RST | P1 | SWC | BOOT | P2 | SWD | SYN | P3 | RST | P9 | P4 | P8 | 3.3v | P5 | GND | P7 | P6 | VIN | 3.3V | GND
bPlace: https://openmv.io | OpenMV3 R1 | OV7725-M7 | LED1=Red | 10/15/2016 | LED2=Green | LED3=Blue | LED4=IR | Built by MacroFab | Made in USA | Pin List | P0=PB15/MOSI | P0 | P1=PB14/MISO | P2=PB13/SCLK | RST | P3=PB12/SS | P1 | P4=PB10/TXD/SCL | SWC | P5=PB11/RXD/SDA | BOOT | P2 | P6=PA5/ADC/DAC | SWD | SYN | P7=PD12/SERVO1 | P3 | P8=PD13/SERVO2 | RST | P9 | P9=PD14/SERVO3 | P4 | P8 | Max voltage: 5v | 3.3v | P5 | GND | P7 | P6 | VIN | 3.3V | GND